# Altium schematic sheet dcdc12v.SchDoc
size 209 x 297 mm; SheetNumber: 1; SheetTotal: 1
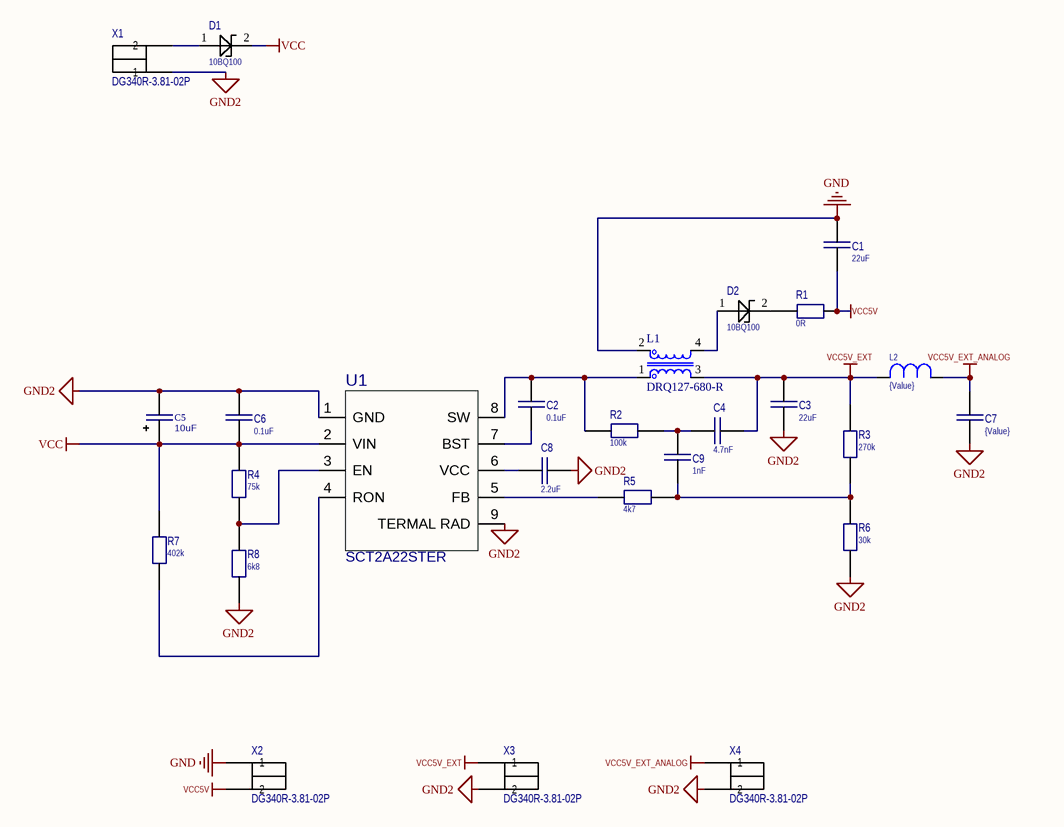
[diagram p0: dcdc12v.SchDoc]

## Parts
C1  22uF  [C_0603]
C2  0.1uF  [C_0603]
C3  22uF  [C_0603]
C4  4.7nF  [C_0603]
C5  10uF  [CAP470X25V]
C6  0.1uF  [C_1206]
C7  {Value}  [C_0603]
C8  2.2uF  [C_0603]
C9  1nF  [C_0603]
D1  10BQ100  [DO-214AA]
D2  10BQ100  [DO-214AA]
L1  DRQ127-680-R  [XFMR_DRQ127-150-R]
L2  {Value}  [CD54NP]
R1  0R  [R_0603]
R2  100k  [R_0603]
R3  270k  [R_0603]
R4  75k  [R_0603]
R5  4k7  [R_0603]
R6  30k  [R_0603]
R7  402k  [R_0603]
R8  6k8  [R_0603]
U1  SCT2A22STER  [ESOP-8]
X1  DG340R-3.81-02P  [340-021-12]
X2  DG340R-3.81-02P  [340-021-12]
X3  DG340R-3.81-02P  [340-021-12]
X4  DG340R-3.81-02P  [340-021-12]

## Nets
GND: C1.2 L1.2 X2.1
GND2: C3.1 C5.1 C6.2 C7.1 C8.1 R6.1 R8.1 U1.1(GND) U1.9(TERMAL_RAD) X1.1 X3.2 X4.2
VCC: C5.2 C6.1 D1.2(K) R4.2 R7.2 U1.2(VIN)
VCC5V: C1.1 R1.1 X2.2
VCC5V_EXT: C3.2 C4.2 L1.3 L2.2 R3.2 X3.1
VCC5V_EXT_ANALOG: C7.2 L2.1 X4.1
NetC2_1: C2.1 U1.7(BST)
NetC2_2: C2.2 L1.1 R2.2 U1.8(SW)
NetC4_1: C4.1 C9.1 R2.1
NetC8_2: C8.2 U1.6(VCC)
NetC9_2: C9.2 R3.1 R5.2 R6.2
NetD1_1: D1.1(A) X1.2
NetD2_1: D2.1(A) L1.4
NetD2_2: D2.2(K) R1.2
NetR4_1: R4.1 R8.2 U1.3(EN)
NetR5_1: R5.1 U1.5(FB)
NetR7_1: R7.1 U1.4(RON)

## Library data of the parts
C1 C3 = C0603: Capacitor; Part Number: CC0603MRX5R6BB226; Alternative Part: CC0603MRX6S5BB226; Value: 22uF
C2 = C0603: Capacitor; Part Number: CC0603KRX7R9BB104; Alternative Part: CC0603MRY5V9BB104; Value: 0.1uF
C4 = C0603: Capacitor; Part Number: CC0603KRX7R9BB472; Alternative Part: CC0603JRX7R9BB472; Value: 4.7nF
C5 = C_10_12_5mm: Capacitor; Part Number: SH160M0010B5S-1012; Value: 10uF; Alternative Part: -
C6 = C1206: Capacitor; Part Number: CC1206KKX7R0BB104; Alternative Part: CC1206JKX7R0BB104; Value: 0.1uF
C7 = C0603: Capacitor; Value: {Value}; Part Number: -; Alternative Part: -
C8 = C0603: Capacitor; Part Number: CC0603KRX5R8BB225; Value: 2.2uF; Alternative Part: -
C9 = C0603: Capacitor; Part Number: CC0603KRX7R9BB102; Alternative Part: CC0603KRX7R8BB102; Value: 1nF
D1 D2 = D_DO-214AA: Diode; Alternative Part: VS-10BQ100; Part Number: 10BQ100
L1 = DRQ127-150-R: Inductor Power Shielded; Package: None; Price: None; Value: *; Part Number: DRQ127-680-R; Availability: Unavailable; Alternative Part: -
L2 = L_CD54NP: Inductor; Value: {Value}; Part Number: -; Alternative Part: -
R1 = R0603: Resistor; Part Number: RC0603JR-070RL; Alternative Part: RC0603JR-100RL; Value: 0R
R2 = R0603: Resistor; Part Number: RC0603FR-07100KL; Alternative Part: RC0603JR-07100KL; Value: 100k
R3 = R0603: Resistor; Part Number: RC0603FR-07270KL; Alternative Part: RC0603JR-07270KL; Value: 270k
R4 = R0603: Resistor; Part Number: RC0603JR-0775KL; Alternative Part: RC0603FR-0775KL; Value: 75k
R5 = R0603: Resistor; Part Number: RC0603FR-074K7L; Alternative Part: RC0603JR-074K7L; Value: 4k7
R6 = R0603: Resistor; Part Number: RC0603FR-0730KL; Alternative Part: RC0603JR-0730KL; Value: 30k
R7 = R0603: Resistor; Part Number: RC0603FR-07402KL; Alternative Part: RC0603FR-13402KL; Value: 402k
R8 = R0603: Resistor; Part Number: RC0603FR-076K8L; Alternative Part: RC0603JR-076K8L; Value: 6k8
U1 = SCT2A22STER: Buck dc/dc; Part Number: SCT2A22STER; Alternative Part: -
X1-X4 = DG340R-3.81-02P: Connectors; Alternative Part: KLS2-340-3.81-02P-2S; Type: DG340R-3.81-02P; Part Number: DG340R-3.81-02P